# EAGLE design TeleMonitor (EAGLE 7.5.0)
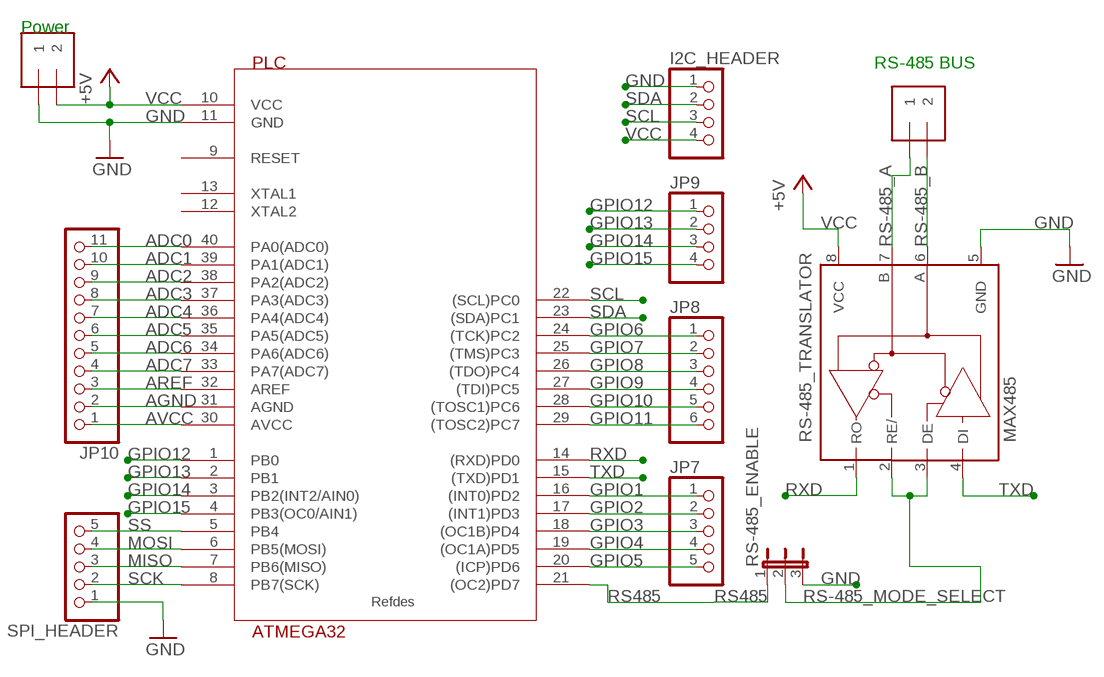
[diagram p0: schematic, sheet 1]

## Parts
I2C_HEADER  PINHD-1X4  [1X04]
JP7  PINHD-1X5  [1X05]
JP8  PINHD-1X6  [1X06]
JP9  PINHD-1X4  [1X04]
JP10  PINHD-1X11  [1X11]
PLC  ATMEGA32  ATMEGA32-PU  [DIL40]
POWER  5MM_TERMINAL_BLOCK-3.5MM  [1X2-3.5MM]
RS-485  5MM_TERMINAL_BLOCK-3.5MM  [1X2-3.5MM]
RS-485_ENABLE  JP2E  [JP2]
RS-485_TRANSLATOR  MAX485  MAX3468CPA  [DIL08]
SPI_HEADER  PINHD-1X5  [1X05]

## Nets
ADC0: JP10.11 PLC.40(PA0(ADC0))
ADC1: JP10.10 PLC.39(PA1(ADC1))
ADC2: JP10.9 PLC.38(PA2(ADC2))
ADC3: JP10.8 PLC.37(PA3(ADC3))
ADC4: JP10.7 PLC.36(PA4(ADC4))
ADC5: JP10.6 PLC.35(PA5(ADC5))
ADC6: JP10.5 PLC.34(PA6(ADC6))
ADC7: JP10.4 PLC.33(PA7(ADC7))
AGND: JP10.2 PLC.31(AGND)
AREF: JP10.3 PLC.32(AREF)
AVCC: JP10.1 PLC.30(AVCC)
GND: I2C_HEADER.1 PLC.11(GND) POWER.1 RS-485_ENABLE.3 RS-485_TRANSLATOR.5(GND) SPI_HEADER.1
GPIO1: JP7.1 PLC.16((INT0)PD2)
GPIO2: JP7.2 PLC.17((INT1)PD3)
GPIO3: JP7.3 PLC.18((OC1B)PD4)
GPIO4: JP7.4 PLC.19((OC1A)PD5)
GPIO5: JP7.5 PLC.20((ICP)PD6)
GPIO6: JP8.1 PLC.24((TCK)PC2)
GPIO7: JP8.2 PLC.25((TMS)PC3)
GPIO8: JP8.3 PLC.26((TDO)PC4)
GPIO9: JP8.4 PLC.27((TDI)PC5)
GPIO10: JP8.5 PLC.28((TOSC1)PC6)
GPIO11: JP8.6 PLC.29((TOSC2)PC7)
GPIO12: JP9.1 PLC.1(PB0)
GPIO13: JP9.2 PLC.2(PB1)
GPIO14: JP9.3 PLC.3(PB2(INT2/AIN0))
GPIO15: JP9.4 PLC.4(PB3(OC0/AIN1))
MISO: PLC.7(PB6(MISO)) SPI_HEADER.3
MOSI: PLC.6(PB5(MOSI)) SPI_HEADER.4
RS485: PLC.21((OC2)PD7) RS-485_ENABLE.1
RS-485_A: RS-485.1 RS-485_TRANSLATOR.7(B)
RS-485_B: RS-485.2 RS-485_TRANSLATOR.6(A)
RS-485_MODE_SELECT: RS-485_ENABLE.2 RS-485_TRANSLATOR.2(RE/) RS-485_TRANSLATOR.3(DE)
RXD: PLC.14((RXD)PD0) RS-485_TRANSLATOR.1(RO)
SCK: PLC.8(PB7(SCK)) SPI_HEADER.2
SCL: I2C_HEADER.3 PLC.22((SCL)PC0)
SDA: I2C_HEADER.2 PLC.23((SDA)PC1)
SS: PLC.5(PB4) SPI_HEADER.5
TXD: PLC.15((TXD)PD1) RS-485_TRANSLATOR.4(DI)
VCC: I2C_HEADER.4 PLC.10(VCC) POWER.2 RS-485_TRANSLATOR.8(VCC) ; supply symbol labelled +5V
Unconnected: PLC.9(RESET) PLC.12(XTAL2) PLC.13(XTAL1)

## Notes on the sheet
- Power
- RS-485 BUS

## Library data of the parts
I2C_HEADER JP9 = pinhead:PINHD-1X4: PIN HEADER
JP7 SPI_HEADER = pinhead:PINHD-1X5: PIN HEADER
JP8 = pinhead:PINHD-1X6: PIN HEADER
JP10 = pinhead:PINHD-1X11: PIN HEADER
PLC = ArpanMTP1:ATMEGA32-PU: ATMEGA32-DIP-Variant
POWER RS-485 = ArpanMTP1:5MM_TERMINAL_BLOCK: 3.5mm Terminal block http://www.ladyada.net/library/pcb/eaglelibrary.html
RS-485_ENABLE = jumper:JP2E: JUMPER
RS-485_TRANSLATOR = maxim:MAX34*: +5V, Fail-Safe, 40Mbps, Profibus RS-485/RS-422 Transceivers Source: MAX3465-MAX3469.pdf; OC_FARNELL: unknown; OC_NEWARK: unknown

## Board
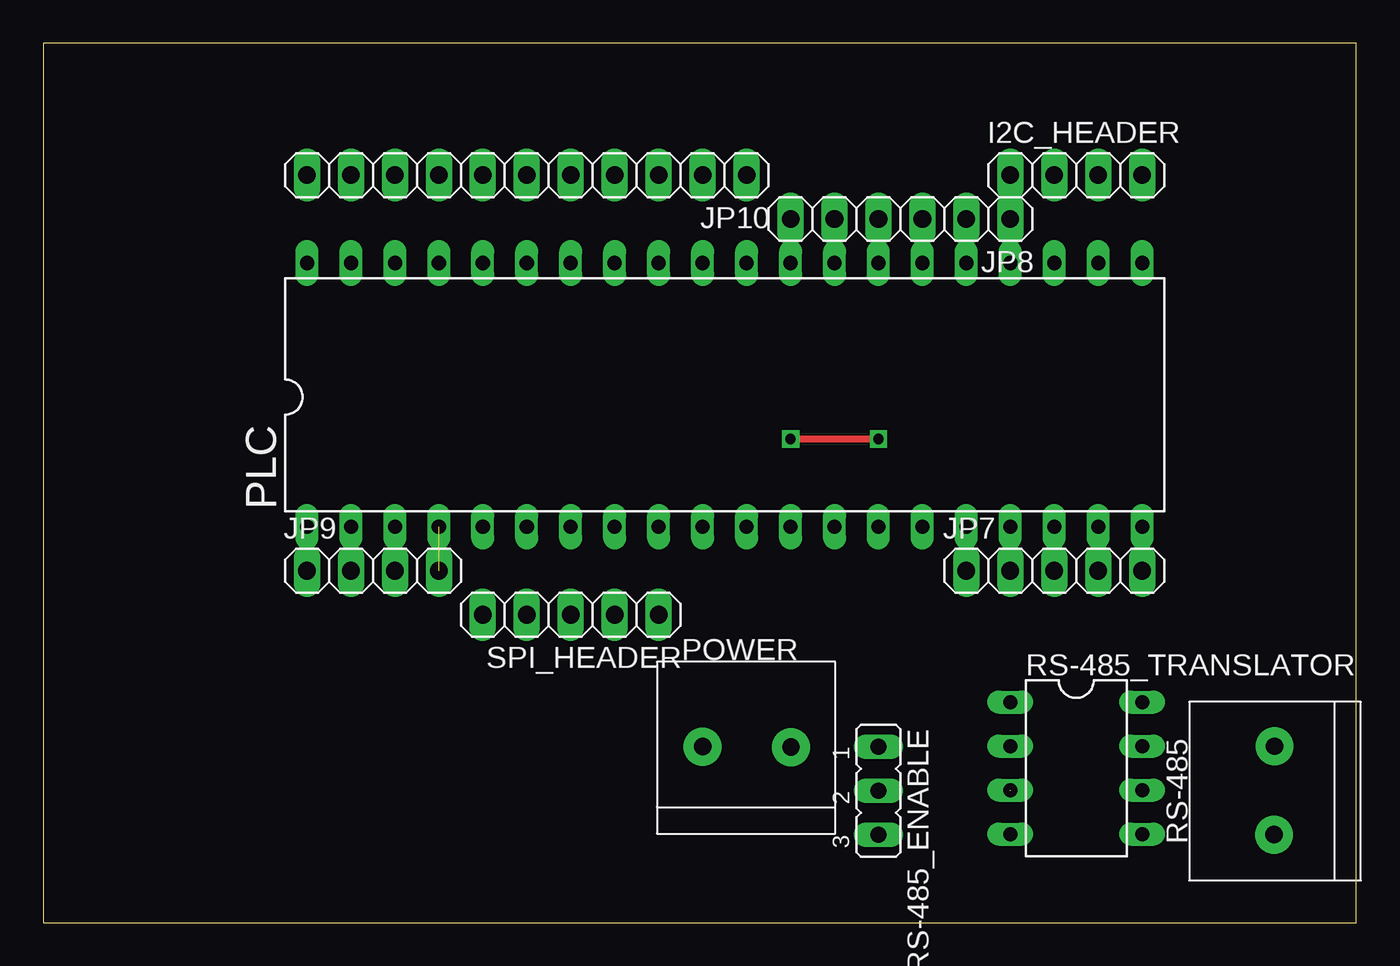
[diagram p1: board, top side]
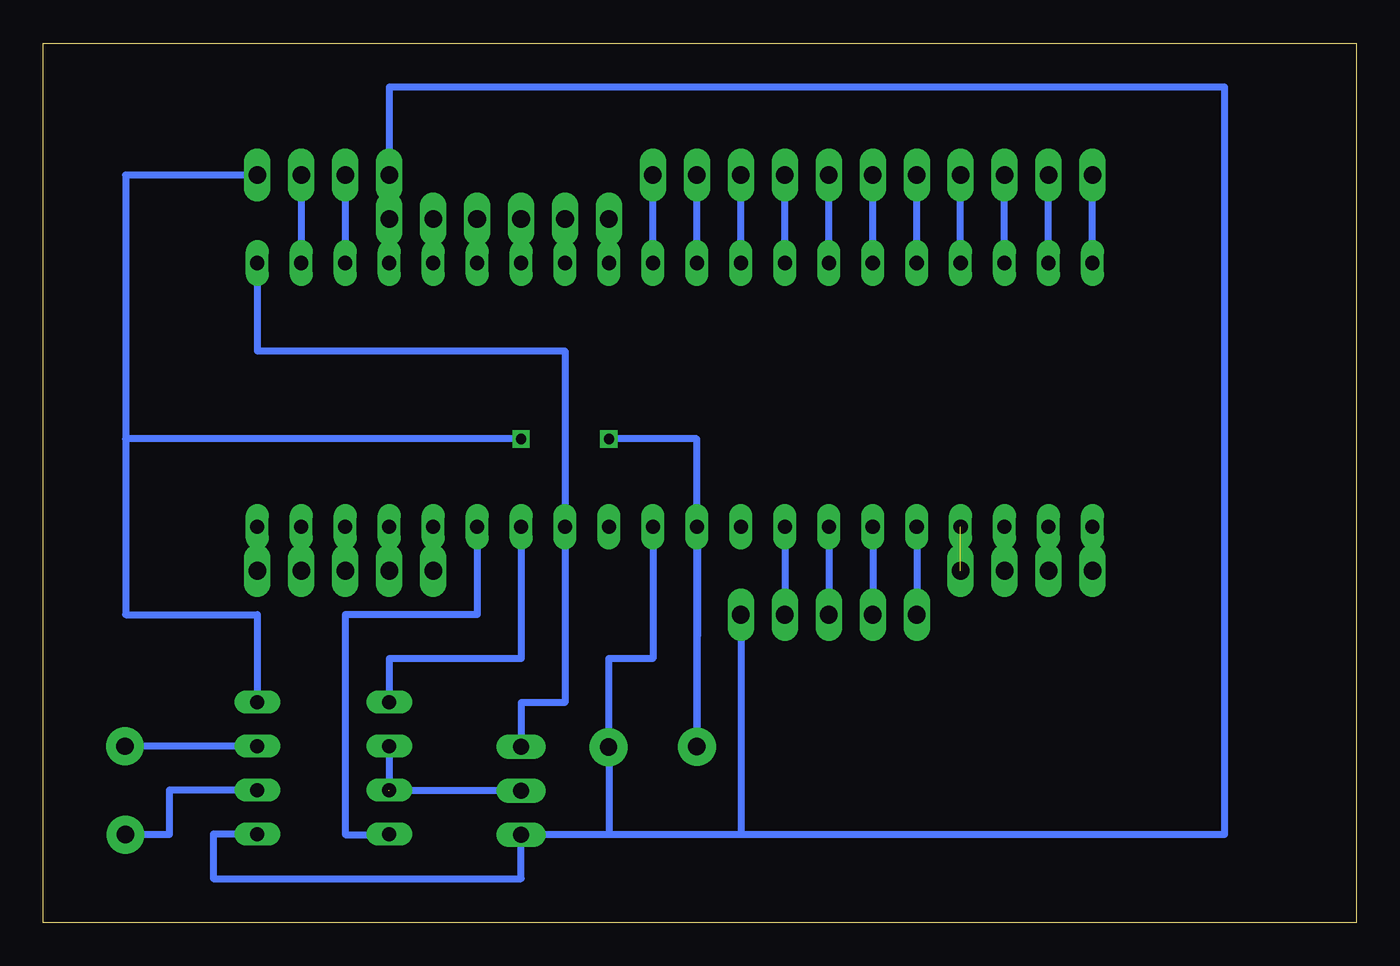
[diagram p2: board, bottom side, seen from below]

Size 75.87 x 50.79 mm. Coordinates in mm from the lower left corner, seen from the top.
Outline: 0,0 75.87,0 75.87,50.79 0,50.79 0,0
Copper layers (1*16): Top 0.035mm / dielectric 1.5mm / Bottom 0.035mm
Design rules "default *": minimum track width 10mil, minimum drill 24mil, track to track 25mil, track to pad 25mil, pad to pad 15mil, via to via 8mil, smd to smd 8mil, copper to edge 40mil, drill to drill 8mil, minimum pad ring 10mil, minimum via ring 8mil, stop-mask expansion 4mil, vias tented up to drill 0mil, thermal gap 10mil

### Footprints (pad centres in the part's own frame; a part is rotated, then mirrored left to right if it is on the bottom)
1X04 = drill 1.016 long: 1 -3.81,0; 2 -1.27,0; 3 1.27,0; 4 3.81,0
1X05 = drill 1.016 long: 1 -5.08,0; 2 -2.54,0; 3 0,0; 4 2.54,0; 5 5.08,0
1X06 = drill 1.016 long: 1 -6.35,0; 2 -3.81,0; 3 -1.27,0; 4 1.27,0; 5 3.81,0; 6 6.35,0
1X11 = drill 1.016 long: 1 -12.7,0; 2 -10.16,0; 3 -7.62,0; 4 -5.08,0; 5 -2.54,0; 6 0,0; 7 2.54,0; 8 5.08,0; 9 7.62,0; 10 10.16,0; 11 12.7,0
DIL40 = drill 0.813 long: 1 -22.86,-7.62; 2 -20.32,-7.62; 3 -17.78,-7.62; 4 -15.24,-7.62; 5 -12.7,-7.62; 6 -10.16,-7.62; 7 -7.62,-7.62; 8 -5.08,-7.62; 9 -2.54,-7.62; 10 0,-7.62; 11 2.54,-7.62; 12 5.08,-7.62; 13 7.62,-7.62; 14 10.16,-7.62; 15 12.7,-7.62; 16 15.24,-7.62; 17 17.78,-7.62; 18 20.32,-7.62; 19 22.86,-7.62; 20 25.4,-7.62; 21 25.4,7.62; 22 22.86,7.62; 23 20.32,7.62; 24 17.78,7.62; 25 15.24,7.62; 26 12.7,7.62; 27 10.16,7.62; 28 7.62,7.62; 29 5.08,7.62; 30 2.54,7.62; 31 0,7.62; 32 -2.54,7.62; 33 -5.08,7.62; 34 -7.62,7.62; 35 -10.16,7.62; 36 -12.7,7.62; 37 -15.24,7.62; 38 -17.78,7.62; 39 -20.32,7.62; 40 -22.86,7.62
1X2-3.5MM = drill 1 pad 2.184: 1 2.562,0; 2 -2.538,0.025
JP2 = drill 0.914 long: 1 -2.54,0; 2 0,0; 3 2.54,0
DIL08 = drill 0.813 long: 1 -3.81,-3.81; 2 -1.27,-3.81; 3 1.27,-3.81; 4 3.81,-3.81; 5 3.81,3.81; 6 1.27,3.81; 7 -1.27,3.81; 8 -3.81,3.81

### Placement (x,y rotation side)
I2C_HEADER  59.69,43.18 0 top
JP7  58.42,20.32 0 top
JP8  49.53,40.64 180 top
JP9  19.05,20.32 0 top
JP10  27.94,43.18 180 top
PLC  38.1,30.48 0 top
POWER  40.64,10.13 0 top
RS-485  71.15,7.62 90 top
RS-485_ENABLE  48.26,7.62 270 top
RS-485_TRANSLATOR  59.69,8.92 270 top
SPI_HEADER  30.48,17.78 180 top

### Tracks (layer width: path | path; a pad name or v marks a point on that pad's centre or on a via)
ADC0
  Bottom 0.406: PLC.40 JP10.11
ADC1
  Bottom 0.406: PLC.39 JP10.10
ADC2
  Bottom 0.406: PLC.38 JP10.9
ADC3
  Bottom 0.406: PLC.37 JP10.8
ADC4
  Bottom 0.406: PLC.36 JP10.7
ADC5
  Bottom 0.406: PLC.35 JP10.6
ADC6
  Bottom 0.406: PLC.34 JP10.5
ADC7
  Bottom 0.406: PLC.33 JP10.4
AGND
  Bottom 0.406: PLC.31 JP10.2
AREF
  Bottom 0.406: PLC.32 JP10.3
AVCC
  Bottom 0.406: PLC.30 JP10.1
GND
  Bottom 0.406: SPI_HEADER.1 35.56,5.08 | 35.56,5.08 43.18,5.08 | 43.18,5.08 RS-485_ENABLE.3 48.26,2.54 66.04,2.54 66.04,5.11 RS-485_TRANSLATOR.5 | PLC.11 40.64,15.24 43.2,15.24 POWER.1 43.18,10.13 43.18,5.08 | 35.56,5.08 7.62,5.08 7.62,48.26 55.88,48.26 I2C_HEADER.1
GPIO1
  Bottom 0.406: PLC.16 JP7.1
GPIO2
  Bottom 0.406: PLC.17 JP7.2
GPIO3
  Bottom 0.406: PLC.18 JP7.3
GPIO4
  Bottom 0.406: PLC.19 JP7.4
GPIO5
  Bottom 0.406: PLC.20 JP7.5
GPIO6
  Bottom 0.406: PLC.24 JP8.1
GPIO7
  Bottom 0.406: PLC.25 JP8.2
GPIO8
  Bottom 0.406: PLC.26 JP8.3
GPIO9
  Bottom 0.406: PLC.27 JP8.4
GPIO10
  Bottom 0.406: PLC.28 JP8.5
GPIO11
  Bottom 0.406: PLC.29 JP8.6
GPIO12
  Bottom 0.406: PLC.1 JP9.1
GPIO13
  Bottom 0.406: PLC.2 JP9.2
GPIO14
  Bottom 0.406: PLC.3 JP9.3
GPIO15  (1 unrouted)
MISO
  Bottom 0.406: PLC.7 SPI_HEADER.3
MOSI
  Bottom 0.406: PLC.6 SPI_HEADER.4
RS485
  Bottom 0.406: PLC.21 63.5,33.02 45.72,33.02 45.72,12.7 48.26,12.7 RS-485_ENABLE.1
RS-485_A
  Bottom 0.406: RS-485_TRANSLATOR.7 RS-485.1
RS-485_B
  Bottom 0.406: RS-485_TRANSLATOR.6 68.58,7.64 68.58,5.08 RS-485.2 | RS-485.2
RS-485_MODE_SELECT  (1 unrouted)
  Bottom 0.406: RS-485_ENABLE.2 55.88,7.62 | RS-485_TRANSLATOR.2 RS-485_TRANSLATOR.3
RXD
  Bottom 0.406: PLC.14 48.26,15.24 55.88,15.24 RS-485_TRANSLATOR.1
SCK
  Bottom 0.406: PLC.8 SPI_HEADER.2
SCL
  Bottom 0.406: I2C_HEADER.3 PLC.22
SDA
  Bottom 0.406: I2C_HEADER.2 PLC.23
SS
  Bottom 0.406: PLC.5 SPI_HEADER.5
TXD
  Bottom 0.406: PLC.15 50.8,17.78 58.42,17.78 58.42,5.08 55.88,5.08 RS-485_TRANSLATOR.4
VCC  (via drill 0.6)
  Top 0.406: v43.18,27.94 v48.26,27.94
  Bottom 0.406: PLC.10 38.05,22.86 POWER.2 PLC.10 | I2C_HEADER.4 71.12,43.18 71.12,27.94 | 71.12,27.94 71.12,17.78 63.5,17.78 RS-485_TRANSLATOR.8 | PLC.10 38.1,27.94 v43.18,27.94 | v48.26,27.94 71.12,27.94